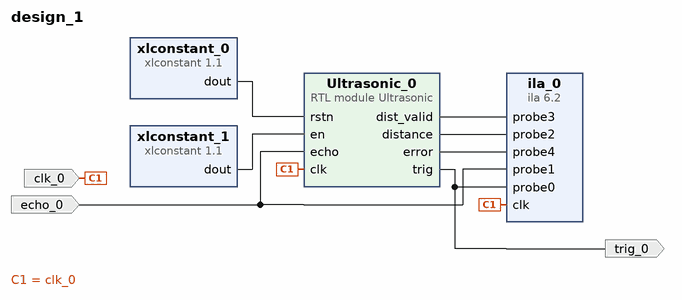
[diagram p0: block diagram of the top level]
# Vivado block design design_1, xc7z020clg484-1, Vivado 2023.2
create_bd_design design_1

create_bd_port -dir I -type clk clk_0
create_bd_port -dir O trig_0
create_bd_port -dir I echo_0

create_bd_cell -type module -reference Ultrasonic Ultrasonic_0
create_bd_cell -type ip -vlnv xilinx.com:ip:xlconstant:1.1 xlconstant_0
create_bd_cell -type ip -vlnv xilinx.com:ip:xlconstant:1.1 xlconstant_1
create_bd_cell -type ip -vlnv xilinx.com:ip:ila:6.2 ila_0
set_property -dict [list \
  CONFIG.C_DATA_DEPTH 131072 \
  CONFIG.C_MONITOR_TYPE Native \
  CONFIG.C_NUM_OF_PROBES 5 \
  CONFIG.C_PROBE2_WIDTH 22 \
] [get_bd_cells ila_0]

# ---- connections ----

connect_bd_net [get_bd_pins Ultrasonic_0/dist_valid] [get_bd_pins ila_0/probe3]
connect_bd_net [get_bd_pins Ultrasonic_0/distance] [get_bd_pins ila_0/probe2]
connect_bd_net [get_bd_pins Ultrasonic_0/error] [get_bd_pins ila_0/probe4]
connect_bd_net [get_bd_pins Ultrasonic_0/trig] [get_bd_ports trig_0] [get_bd_pins ila_0/probe0]
connect_bd_net -net clk_0_1 [get_bd_ports clk_0] [get_bd_pins Ultrasonic_0/clk] [get_bd_pins ila_0/clk]
connect_bd_net -net echo_0_1 [get_bd_ports echo_0] [get_bd_pins Ultrasonic_0/echo] [get_bd_pins ila_0/probe1]
connect_bd_net [get_bd_pins xlconstant_0/dout] [get_bd_pins Ultrasonic_0/rstn]
connect_bd_net [get_bd_pins xlconstant_1/dout] [get_bd_pins Ultrasonic_0/en]

validate_bd_design
save_bd_design
